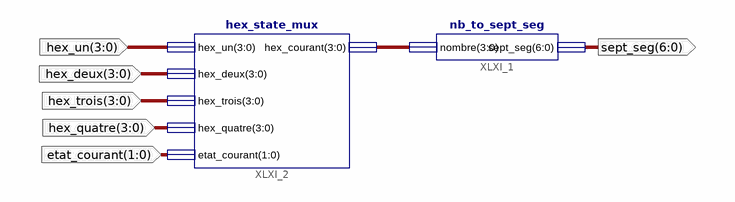
[diagram p0: schematic sheet 1]
// Xilinx ISE schematic afficheur_sept_seg_sch.sch (spartan3e) as structural Verilog: 2 symbols, 6 ports
module afficheur_sept_seg_sch (
  input  [3:0] hex_un,
  input  [3:0] hex_deux,
  input  [3:0] hex_trois,
  input  [3:0] hex_quatre,
  input  [1:0] etat_courant,
  output [6:0] sept_seg
);

  wire [3:0] XLXN_1;

  nb_to_sept_seg XLXI_1 (.nombre(XLXN_1), .sept_seg(sept_seg));
  hex_state_mux XLXI_2 (
    .hex_un(hex_un), .hex_deux(hex_deux), .hex_trois(hex_trois), .hex_quatre(hex_quatre),
    .etat_courant(etat_courant), .hex_courant(XLXN_1));
endmodule
